# EasyEDA schematic 1-Schematic_Plan B elektronisch schema_ok.json
TITLE: Plan B; REV: 1.0; Date: 2025-12-12; Sheet: 1/1; Drawn By: Ruben Van Landuyt; Company: Hogent
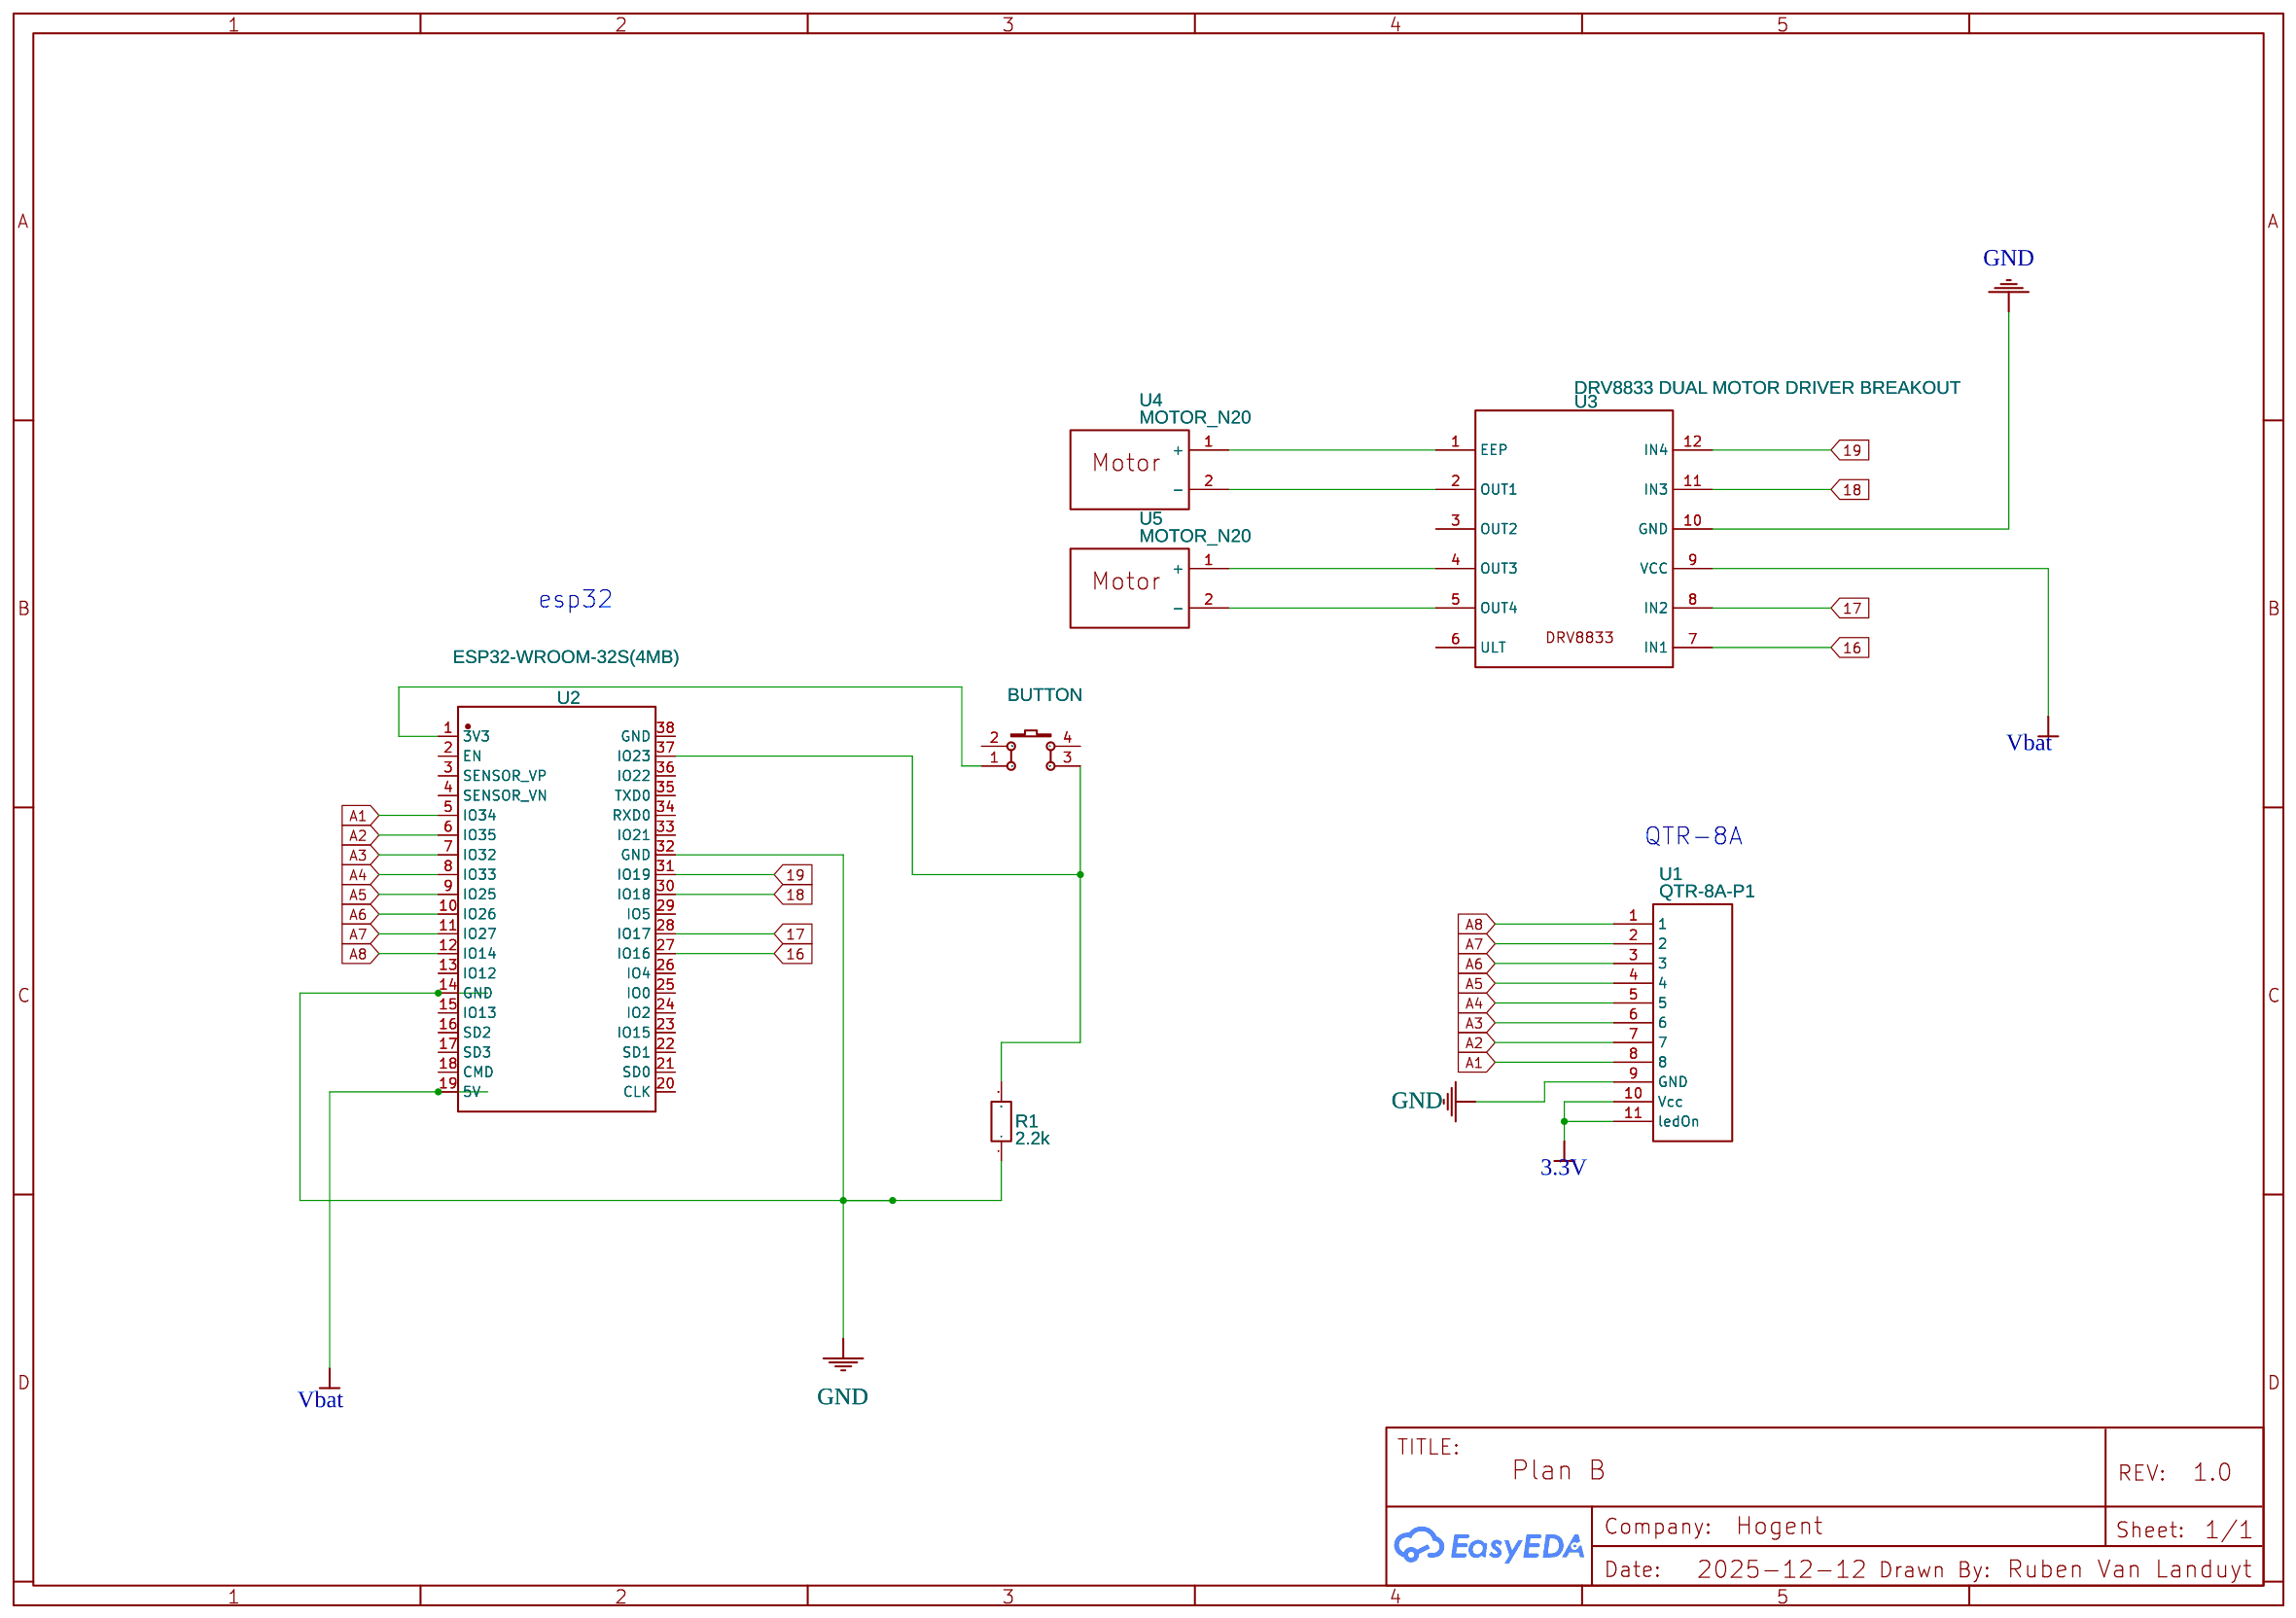
[diagram p0: schematic sheet]

## Parts
BUTTON  K4-6×6_SMD  [KEY-SMD_4P-L6.0-W6.0-P4.50-LS8.6]
R1  2.2k  [R0805]
U1  QTR-8A-P1  [QTR-8A-P1]
U2  ESP32-WROOM-32S(4MB)  [WIFIM-SMD_39P-L19.2-W18.0-P1.27]
U3  DRV8833 DUAL MOTOR DRIVER BREAKOUT  [DRV8833 DUAL MOTOR DRIVER M]
U4  MOTOR_N20  [MOTOR N20]
U5  MOTOR_N20  [MOTOR N20]

## Library data of the parts
BUTTON = K4-6×6_SMD: Supplier Part: C191626; Supplier: LCSC; Manufacturer: 韩国韩荣; Manufacturer Part: K2-6639SP-D4SC-04; Contributor: LCEDA_Lib
R1 = R_0805_EU: Contributor: LCEDA_Lib
U1 = QTR-8A-P1: Contributor: stan_goditiabois
U2 = ESP32-WROOM-32S(4MB): Supplier: LCSC; Supplier Part: C529580; Manufacturer: Espressif Systems; Contributor: Aaron Hentschel; JLCPCB Part Class: Extended Part
U3 = DRV8833 DUAL MOTOR DRIVER BREAKOUT: Contributor: ayush2002; sourceId: YsmgyP7pj
U4 U5 = MOTOR_N20: Contributor: alexun9999

## Nets
3.3V: U1.10(Vcc) U1.11(ledOn)
GND: R1.1 U1.9(GND) U2.14(GND) U2.32(GND) U3.10(GND)
Vbat: U2.19(5V) U3.9(VCC)
16: U2.27(IO16) U3.7(IN1)
17: U2.28(IO17) U3.8(IN2)
18: U2.30(IO18) U3.11(IN3)
19: U2.31(IO19) U3.12(IN4)
A1: U1.8 U2.5(IO34)
A2: U1.7 U2.6(IO35)
A3: U1.6 U2.7(IO32)
A4: U1.5 U2.8(IO33)
A5: U1.4 U2.9(IO25)
A6: U1.3 U2.10(IO26)
A7: U1.2 U2.11(IO27)
A8: U1.1 U2.12(IO14)
Net-(BUTTON-1): BUTTON.1 U2.1(3V3)
Net-(BUTTON-3): BUTTON.3 R1.2 U2.37(IO23)
Net-(U3-1): U3.1(EEP) U4.1(+)
Net-(U3-2): U3.2(OUT1) U4.2(-)
Net-(U3-4): U3.4(OUT3) U5.1(+)
Net-(U3-5): U3.5(OUT4) U5.2(-)

Not connected (* = marked no-connect by the designer): BUTTON 2 4; U2 2(EN) 3(SENSOR_VP) 4(SENSOR_VN) 13(IO12) 15(IO13) 16(SD2) 17(SD3) 18(CMD) 20(CLK) 21(SD0) 22(SD1) 23(IO15) 24(IO2) 25(IO0) 26(IO4) 29(IO5) 33(IO21) 34(RXD0) 35(TXD0) 36(IO22) 38(GND); U3 3(OUT2) 6(ULT)

## Notes on the sheet
- esp32
- QTR-8A
